# Altium schematic sheet SENSOR_LDO.SchDoc
size A2; SheetNumber: 2; SheetTotal: 5
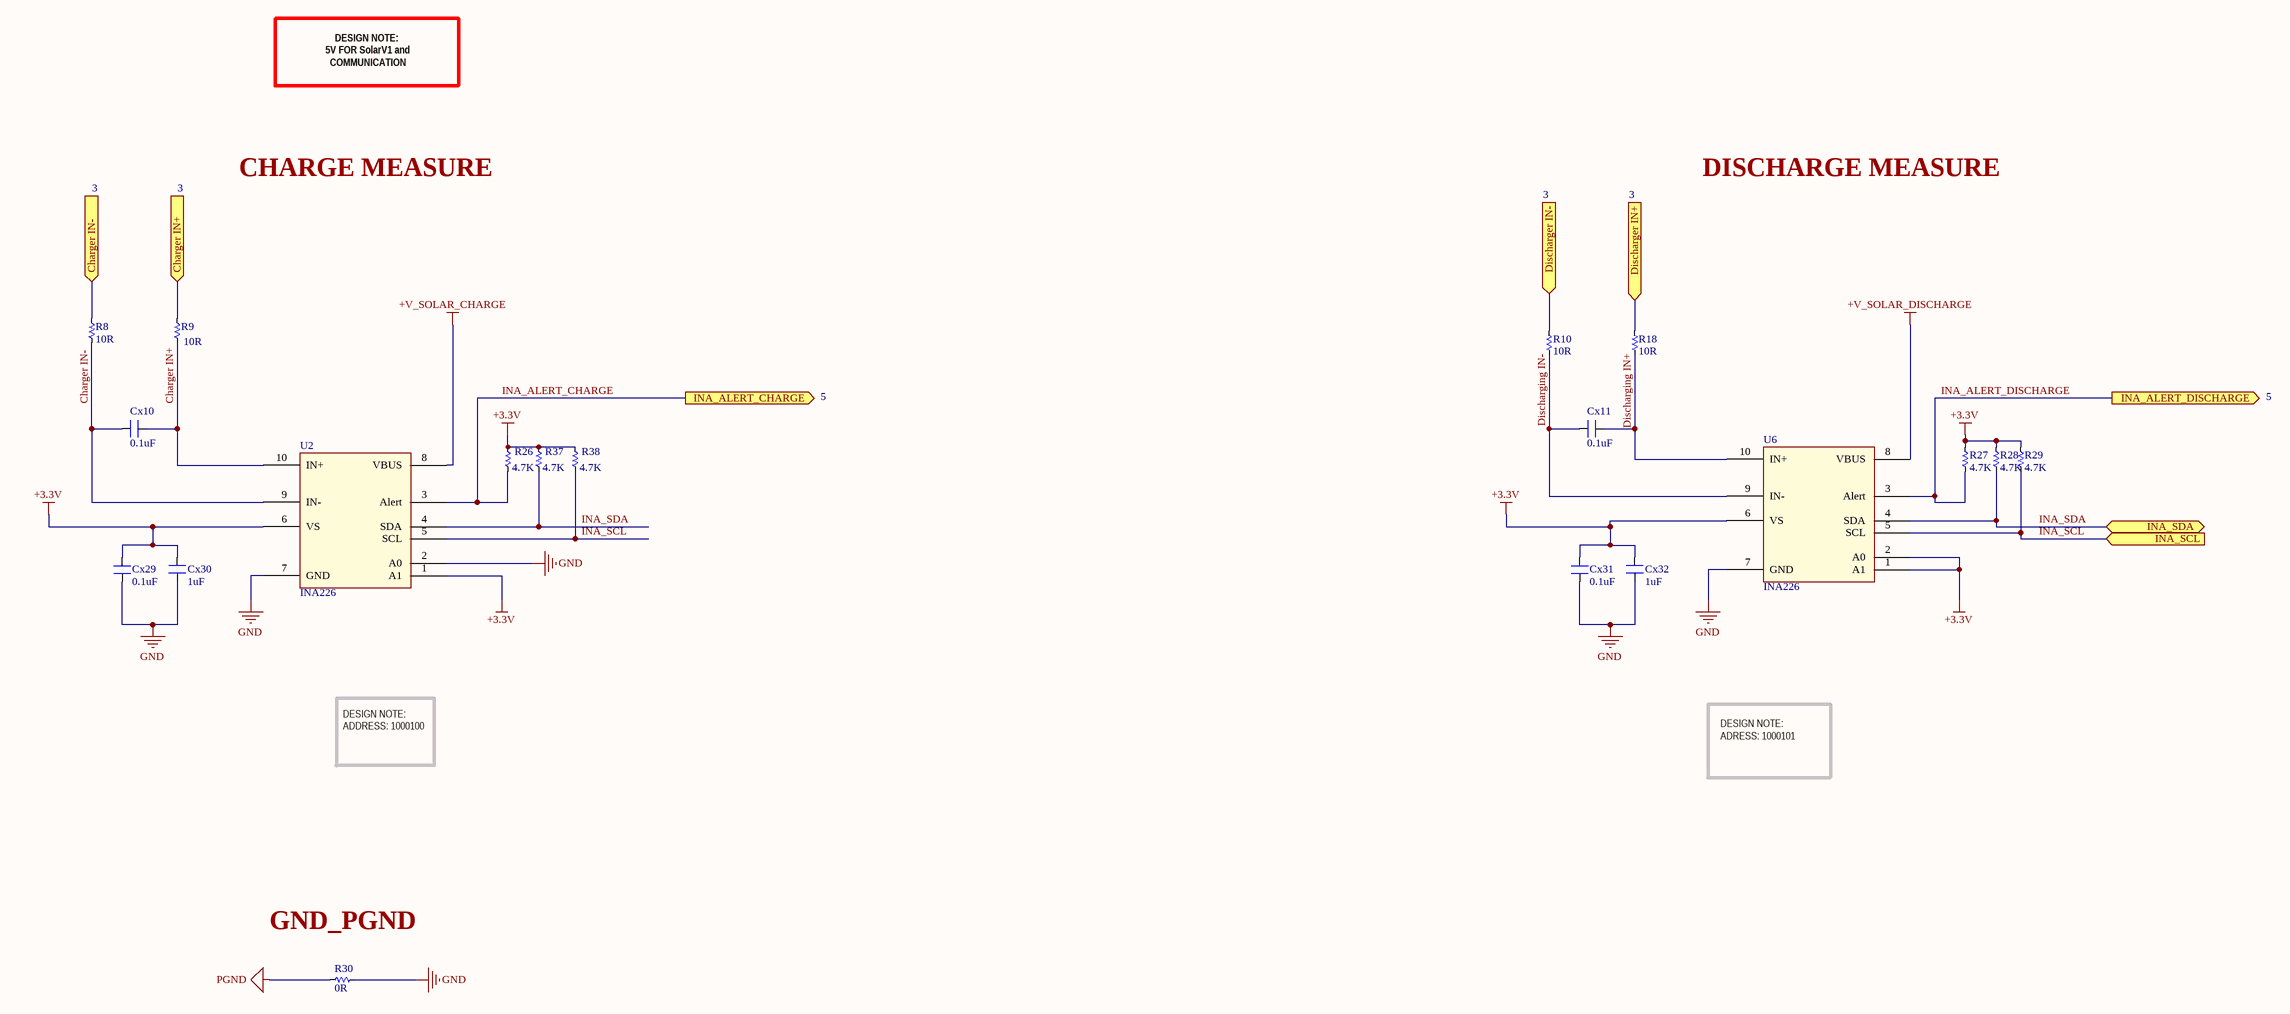
[diagram p0: SENSOR_LDO.SchDoc]

## Parts
Cx10  0.1uF  [CN-SMD-0805]
Cx11  0.1uF  [CN-SMD-0805]
Cx29  0.1uF  [CN-SMD-0805]
Cx30  1uF  [CN-SMD-0805]
Cx31  0.1uF  [CN-SMD-0805]
Cx32  1uF  [CN-SMD-0805]
R8  10R  [RES-SMD-0805]
R9  10R  [RES-SMD-0805]
R10  10R  [RES-SMD-0805]
R18  10R  [RES-SMD-0805]
R26  4.7K  [RES-SMD-0805]
R27  4.7K  [RES-SMD-0805]
R28  4.7K  [RES-SMD-0805]
R29  4.7K  [RES-SMD-0805]
R30  0R  [RES-SMD-0805]
R37  4.7K  [RES-SMD-0805]
R38  4.7K  [RES-SMD-0805]
U2  INA226  [INA226]
U6  INA226  [INA226]

## Ports
Charger IN+ (in), Charger IN- (in), Discharger IN+ (in), Discharger IN- (in), INA_ALERT_CHARGE (out), INA_ALERT_DISCHARGE (out), INA_SCL (in), INA_SDA (bidir)

## Nets
+3.3V: Cx29.2 Cx30.1 Cx31.2 Cx32.1 R26.1 R27.1 R28.1 R29.1 R37.1 R38.1 U2.1(A1) U2.6(VS) U6.1(A1) U6.2(A0) U6.6(VS)
+V_SOLAR_CHARGE: U2.8(VBUS)
+V_SOLAR_DISCHARGE: U6.8(VBUS)
GND: Cx29.1 Cx30.2 Cx31.1 Cx32.2 R30.1 U2.2(A0) U2.7(GND) U6.7(GND)
PGND: R30.2
Charger IN+: Cx10.1 R9.2 U2.10(IN+)
Charger IN+: R9.1 ; port Charger IN+  [a separate net that carries the same name]
Charger IN-: Cx10.2 R8.2 U2.9(IN-)
Charger IN-: R8.1 ; port Charger IN-  [a separate net that carries the same name]
Discharger IN+: R18.1 ; port Discharger IN+
Discharger IN-: R10.1 ; port Discharger IN-
Discharging IN+: Cx11.1 R18.2 U6.10(IN+)
Discharging IN-: Cx11.2 R10.2 U6.9(IN-)
INA_ALERT_CHARGE: R26.2 U2.3(Alert) ; port INA_ALERT_CHARGE
INA_ALERT_DISCHARGE: R27.2 U6.3(Alert) ; port INA_ALERT_DISCHARGE
INA_SCL: R29.2 R38.2 U2.5(SCL) U6.5(SCL) ; port INA_SCL
INA_SDA: R28.2 R37.2 U2.4(SDA) U6.4(SDA) ; port INA_SDA

## Notes on the sheet
- DESIGN NOTE:
  5V FOR SolarV1 and COMMUNICATION
- CHARGE MEASURE
- DISCHARGE MEASURE
- DESIGN NOTE:
  ADDRESS: 1000100
- DESIGN NOTE:
  ADRESS: 1000101
- (near R30) GND_PGND

## Library data of the parts
Cx10 Cx11 Cx29-Cx32 = CN: Value: 33pF
R8-R10 R18 R26-R30 R37 R38 = Res-SMD: Resistor; Manufacturer: Generic Components; Class: Passive; Published: 08/06/2000; Publisher: Altium Hobart Technology Centre
U2 U6 = INA INA226AIDGSR: IC MONITOR PWR/CURR BIDIR 10MSOP